# Altium schematic sheet DSPclk.SchDoc: Clock Management
size A4; Date: 08.04.2017; Author: Jan Petrik; CompanyName: FreeDSP; DrawnBy: Jan Petrik; Organization: FreeDSP; DocumentNumber: 8; Revision: B2; SheetNumber: 8; SheetTotal: 16; email: jan_petrik@centrum.cz; license: CC BY-NC 4.0
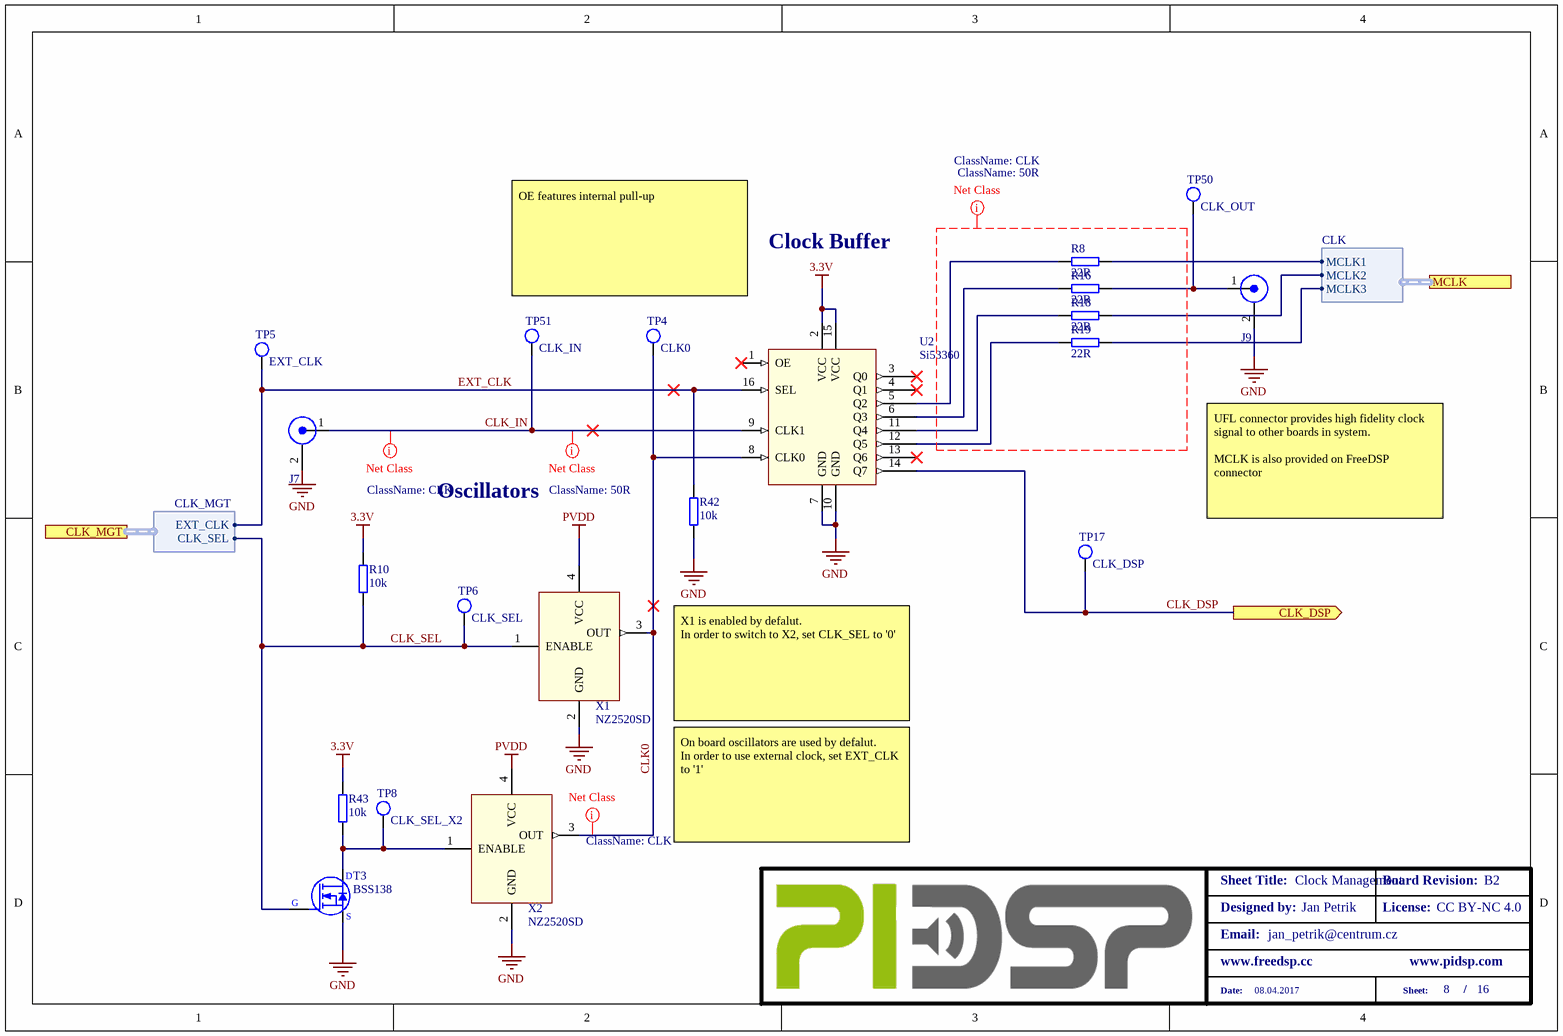
[diagram p0: DSPclk.SchDoc]

## Parts
J7  CLK_IN  [U.FL-R-SMT]  (value not drawn)
J9  CLK_OUT  [U.FL-R-SMT]  (value not drawn)
R8  22R  [RESC1608X06N(SMR0603)]
R10  10k  [RESC1608X06N(SMR0603)]
R16  22R  [RESC1608X06N(SMR0603)]
R18  22R  [RESC1608X06N(SMR0603)]
R19  22R  [RESC1608X06N(SMR0603)]
R42  10k  [RESC1608X06N(SMR0603)]
R43  10k  [RESC1608X06N(SMR0603)]
T3  BSS138  [SOT95P230X110-3N(SOT23)]
TP4  CLK0  [TP_0.8/0.4_ROUND]  (no BOM)
TP5  EXT_CLK  [TP_0.8/0.4_ROUND]  (no BOM)
TP6  CLK_SEL  [TP_0.8/0.4_ROUND]  (no BOM)
TP8  CLK_SEL_X2  [TP_0.8/0.4_ROUND]  (no BOM)
TP17  CLK_DSP  [TP_0.8/0.4_ROUND]  (no BOM)
TP50  CLK_OUT  [TP_0.8/0.4_ROUND]  (no BOM)
TP51  CLK_IN  [TP_0.8/0.4_ROUND]  (no BOM)
U2  Si53360  [TSOP65P640X120-16N (TSSOP16-4.4MM)]
X1  NZ2520SD  [2.5x2mm osclillator]
X2  NZ2520SD  [2.5x2mm osclillator]

## Ports
CLK_DSP (out), CLK_MGT (harness CLK_MGT), MCLK (harness CLK)

## Harnesses
CLK: MCLK1, MCLK2, MCLK3
CLK_MGT: EXT_CLK, CLK_SEL

## Nets
3.3V: R10.2 R43.2 U2.2(VCC) U2.15(VCC)
GND: J7.2(GND) J9.2(GND) R42.1 T3.2(S) U2.7(GND) U2.10(GND) X1.2(GND) X2.2(GND)
PVDD: X1.4(VCC) X2.4(VCC)
CLK0: TP4.1 U2.8(CLK0) X1.3(OUT) X2.3(OUT)
CLK_DSP: TP17.1 U2.14(Q7) ; port CLK_DSP
CLK_IN: J7.1(Signal) TP51.1 U2.9(CLK1)
CLK_SEL: R10.1 T3.1(G) TP6.1 X1.1(ENABLE) ; port CLK_MGT.CLK_SEL
EXT_CLK: R42.2 TP5.1 U2.16(SEL) ; port CLK_MGT.EXT_CLK
NetJ9_1: J9.1(Signal) R16.2 TP50.1
NetR8_1: R8.1 U2.5(Q2)
NetR8_2: R8.2 ; port MCLK.MCLK1
NetR16_1: R16.1 U2.6(Q3)
NetR18_1: R18.1 U2.11(Q4)
NetR18_2: R18.2 ; port MCLK.MCLK2
NetR19_1: R19.1 U2.12(Q5)
NetR19_2: R19.2 ; port MCLK.MCLK3
NetR43_1: R43.1 T3.3(D) TP8.1 X2.1(ENABLE)

Not connected (* = marked no-connect by the designer): U2 1(OE)* 3(Q0)* 4(Q1)* 13(Q6)*

## Layout directives
net class CLK: CLK0, CLK_IN
net class CLK; net class 50R: (no net found under the mark)
net class 50R: CLK_IN

## Notes on the sheet
- Clock Buffer
- OE features internal pull-up
- Oscillators
- UFL connector provides high fidelity clock signal to other boards in system.
  MCLK is also provided on FreeDSP connector
- X1 is enabled by defalut.
  In order to switch to X2, set CLK_SEL to '0'
- On board oscillators are used by defalut.
  In order to use external clock, set EXT_CLK to '1'
- Designed by:
- Sheet Title:
- Board Revision:
- License:
- Email:
- www.freedsp.cc
- www.pidsp.com
- Date:
- Sheet:
- /

## Library data of the parts
J7 J9 = UFL: Subminiature connector; Mfg. PN: 1909763-1; SMD: 0; Supplier 1: Mouser; Supplier Part Number 1: 571-1909763-1
R8 R16 R18 R19 = 22R-100mW-0603-ThickFilm: Chip Resistor; Tolerance & Rating: 1%/0.1W; Signal Integrity: Res; Packare: SMR0603; Value: 22R; Simulation: Res; Author: JP/10.06.2014; SMD: 1; Supplier 1: Mouser; Supplier Part Number 1: 603-RC0603FR-0722RL; Type: Resistor
R10 R42 R43 = 10k-100mW-0603-ThickFilm: Chip Resistor; Tolerance & Rating: 1%/0.1W; Signal Integrity: Res; Packare: SMR0603; Value: 10k; Simulation: Res; Author: JP/10.06.2014; SMD: 1; Supplier 1: Mouser; Supplier Part Number 1: 603-RC0603FR-0710KL; Type: Resistor
T3 = ET+BSS138XX0: N-MOSFET, Logic Level, 50V/0,22A/3.5Ohm; Tolerance & Rating: 50 V/0,2 A/0,36 W; Author: JM 2.7.2014; SMD: 1; Value: BSS138; PN: BSS138; Supplier 1: Mouser; Supplier Part Number 1: 512-BSS138
TP4-TP6 TP8 TP17 TP50 TP51 = TEST_POINT_VIA: Testpoint - VIA; Value: 0.65/1.55; SMD: -; ClassName: TP
U2 = Si53360: 1:8 LOW JITTER CMOS CLOCK BUFFER  WITH 2:1 INPUT MUX; SMD: 1; Supplier 1: Mouser; Value: Si53360; Supplier Part Number 1: 634-SI53360-B-GT
X1 X2 = NZ2520SD: Low Phase Noise Oscillator